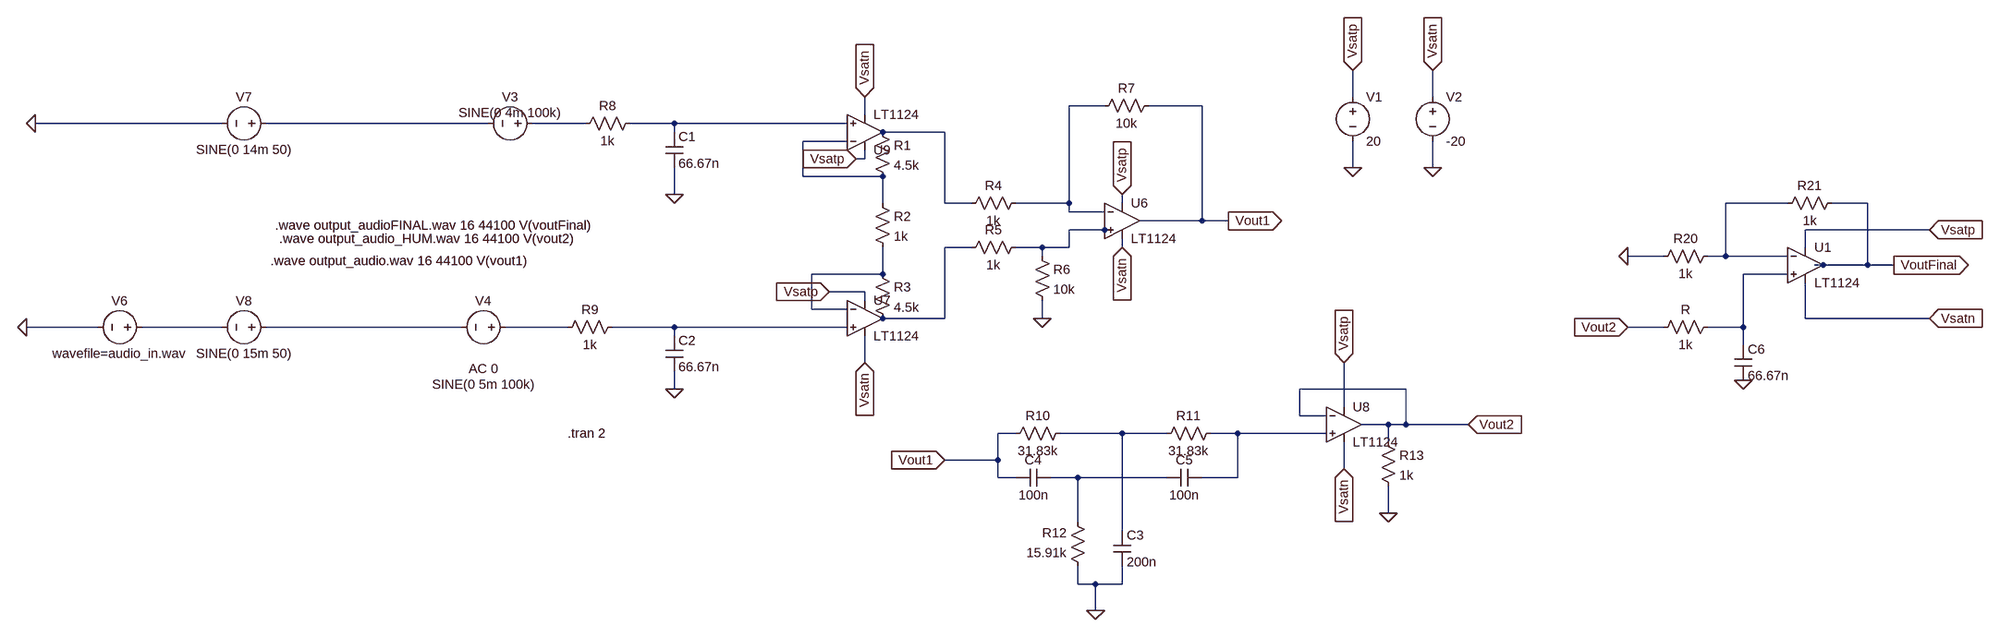
[diagram p0: schematic Instrumental_audio_amplifier_with_50HzhumSuppress.asc]
Instrumental_audio_amplifier_with_50HzhumSuppress.asc, the LTspice schematic file:
Version 4.1
SHEET 1 2400 900
WIRE 816 -48 816 -96
WIRE 960 -48 960 -96
WIRE 368 -32 304 -32
WIRE 544 -32 448 -32
WIRE -64 -16 -64 -48
WIRE -1312 0 -1648 0
WIRE -832 0 -1232 0
WIRE -656 0 -752 0
WIRE -496 0 -576 0
WIRE -96 0 -496 0
WIRE -496 16 -496 0
WIRE 80 16 -32 16
WIRE -96 32 -176 32
WIRE -64 64 -64 48
WIRE -64 64 -80 64
WIRE 816 80 816 32
WIRE 960 80 960 32
WIRE -176 96 -176 32
WIRE -32 96 -176 96
WIRE -496 128 -496 80
WIRE -32 144 -32 96
WIRE 80 144 80 16
WIRE 128 144 80 144
WIRE 304 144 304 -32
WIRE 304 144 208 144
WIRE 400 144 400 128
WIRE 1600 144 1488 144
WIRE 1744 144 1680 144
WIRE 304 160 304 144
WIRE 368 160 304 160
WIRE 544 176 544 -32
WIRE 544 176 432 176
WIRE 592 176 544 176
WIRE 368 192 304 192
WIRE 384 192 368 192
WIRE 1856 192 1632 192
WIRE 128 224 80 224
WIRE 256 224 208 224
WIRE 304 224 304 192
WIRE 304 224 256 224
WIRE 400 224 400 208
WIRE 1632 224 1632 192
WIRE 256 240 256 224
WIRE 1376 240 1312 240
WIRE 1488 240 1488 144
WIRE 1488 240 1456 240
WIRE 1600 240 1488 240
WIRE 1664 256 1648 256
WIRE 1744 256 1744 144
WIRE 1744 256 1664 256
WIRE 1792 256 1744 256
WIRE -32 272 -32 224
WIRE -32 272 -160 272
WIRE 1600 272 1520 272
WIRE -64 304 -128 304
WIRE -64 320 -64 304
WIRE -160 336 -160 272
WIRE -96 336 -160 336
WIRE 80 352 80 224
WIRE 80 352 -32 352
WIRE 256 352 256 320
WIRE 1632 352 1632 288
WIRE 1856 352 1632 352
WIRE -1536 368 -1664 368
WIRE -1312 368 -1456 368
WIRE -880 368 -1232 368
WIRE -688 368 -800 368
WIRE -496 368 -608 368
WIRE -96 368 -496 368
WIRE 1376 368 1312 368
WIRE 1520 368 1520 272
WIRE 1520 368 1456 368
WIRE -496 384 -496 368
WIRE 1520 400 1520 368
WIRE -64 432 -64 384
WIRE -496 480 -496 448
WIRE 912 480 720 480
WIRE 800 512 800 432
WIRE 720 528 720 480
WIRE 768 528 720 528
WIRE 880 544 832 544
WIRE 912 544 912 480
WIRE 912 544 880 544
WIRE 1024 544 912 544
WIRE 208 560 176 560
WIRE 400 560 288 560
WIRE 480 560 400 560
WIRE 608 560 560 560
WIRE 768 560 608 560
WIRE 880 576 880 544
WIRE 176 608 176 560
WIRE 176 608 80 608
WIRE 800 624 800 576
WIRE 176 640 176 608
WIRE 208 640 176 640
WIRE 320 640 272 640
WIRE 480 640 320 640
WIRE 608 640 608 560
WIRE 608 640 544 640
WIRE 880 704 880 656
WIRE 320 720 320 640
WIRE 400 736 400 560
WIRE 320 832 320 800
WIRE 352 832 320 832
WIRE 400 832 400 800
WIRE 400 832 352 832
WIRE 352 880 352 832
FLAG 592 176 Vout1
IOPIN 592 176 Out
FLAG 256 352 0
FLAG 816 -96 Vsatp
IOPIN 816 -96 In
FLAG 960 -96 Vsatn
IOPIN 960 -96 In
FLAG 816 80 0
FLAG 960 80 0
FLAG -80 64 Vsatp
IOPIN -80 64 In
FLAG -128 304 Vsatp
IOPIN -128 304 In
FLAG 400 128 Vsatp
IOPIN 400 128 In
FLAG 400 224 Vsatn
IOPIN 400 224 In
FLAG -64 -48 Vsatn
IOPIN -64 -48 In
FLAG -64 432 Vsatn
IOPIN -64 432 In
FLAG -496 480 0
FLAG -496 128 0
FLAG -1664 368 0
FLAG -1648 0 0
FLAG 880 704 0
FLAG 352 880 0
FLAG 80 608 Vout1
IOPIN 80 608 In
FLAG 800 432 Vsatp
IOPIN 800 432 In
FLAG 800 624 Vsatn
IOPIN 800 624 In
FLAG 1024 544 Vout2
IOPIN 1024 544 In
FLAG 1312 240 0
FLAG 1520 464 0
FLAG 1856 192 Vsatp
IOPIN 1856 192 In
FLAG 1856 352 Vsatn
IOPIN 1856 352 In
FLAG 1792 256 VoutFinal
IOPIN 1792 256 Out
FLAG 1312 368 Vout2
IOPIN 1312 368 In
SYMBOL res -48 0 R0
SYMATTR InstName R1
SYMATTR Value 4.5k
SYMBOL res -48 128 R0
SYMATTR InstName R2
SYMATTR Value 1k
SYMBOL res -48 256 R0
SYMATTR InstName R3
SYMATTR Value 4.5k
SYMBOL res 224 128 R90
WINDOW 0 0 56 VBottom 2
WINDOW 3 32 56 VTop 2
SYMATTR InstName R4
SYMATTR Value 1k
SYMBOL res 224 208 R90
WINDOW 0 0 56 VBottom 2
WINDOW 3 32 56 VTop 2
SYMATTR InstName R5
SYMATTR Value 1k
SYMATTR SpiceLine tol=0
SYMBOL res 240 224 R0
SYMATTR InstName R6
SYMATTR Value 10k
SYMATTR SpiceLine tol=0
SYMBOL voltage 816 -64 R0
WINDOW 123 0 0 Left 0
WINDOW 39 0 0 Left 0
SYMATTR InstName V1
SYMATTR Value 20
SYMBOL voltage 960 -64 R0
WINDOW 123 0 0 Left 0
WINDOW 39 0 0 Left 0
SYMATTR InstName V2
SYMATTR Value -20
SYMBOL res 464 -48 R90
WINDOW 0 0 56 VBottom 2
WINDOW 3 32 56 VTop 2
SYMATTR InstName R7
SYMATTR Value 10k
SYMBOL voltage -736 0 R90
WINDOW 0 -32 56 VBottom 2
WINDOW 3 -4 56 VBottom 2
WINDOW 123 -4 56 VBottom 2
WINDOW 39 0 0 Left 0
SYMATTR InstName V3
SYMATTR Value SINE(0 4m 100k)
SYMBOL voltage -784 368 R90
WINDOW 0 -32 56 VBottom 2
WINDOW 3 88 56 VTop 2
WINDOW 123 60 56 VTop 2
WINDOW 39 0 0 Left 0
SYMATTR InstName V4
SYMATTR Value SINE(0 5m 100k)
SYMATTR Value2 AC 0
SYMBOL res -560 -16 R90
WINDOW 0 0 56 VBottom 2
WINDOW 3 32 56 VTop 2
SYMATTR InstName R8
SYMATTR Value 1k
SYMBOL res -592 352 R90
WINDOW 0 0 56 VBottom 2
WINDOW 3 32 56 VTop 2
SYMATTR InstName R9
SYMATTR Value 1k
SYMBOL cap -512 16 R0
SYMATTR InstName C1
SYMATTR Value 66.67n
SYMBOL cap -512 384 R0
SYMATTR InstName C2
SYMATTR Value 66.67n
SYMBOL voltage -1440 368 R90
WINDOW 0 -32 56 VBottom 2
WINDOW 3 32 56 VTop 2
WINDOW 123 0 0 Left 0
WINDOW 39 0 0 Left 0
SYMATTR InstName V6
SYMATTR Value wavefile=audio_in.wav
SYMBOL res 304 544 R90
WINDOW 0 0 56 VBottom 2
WINDOW 3 32 56 VTop 2
SYMATTR InstName R10
SYMATTR Value 31.83k
SYMBOL res 576 544 R90
WINDOW 0 0 56 VBottom 2
WINDOW 3 32 56 VTop 2
SYMATTR InstName R11
SYMATTR Value 31.83k
SYMBOL res 336 816 R180
WINDOW 0 36 76 Left 2
WINDOW 3 36 40 Left 2
SYMATTR InstName R12
SYMATTR Value 15.91k
SYMBOL cap 384 736 R0
SYMATTR InstName C3
SYMATTR Value 200n
SYMBOL cap 272 624 R90
WINDOW 0 0 32 VBottom 2
WINDOW 3 32 32 VTop 2
SYMATTR InstName C4
SYMATTR Value 100n
SYMBOL cap 544 624 R90
WINDOW 0 0 32 VBottom 2
WINDOW 3 32 32 VTop 2
SYMATTR InstName C5
SYMATTR Value 100n
SYMBOL res 864 560 R0
SYMATTR InstName R13
SYMATTR Value 1k
SYMBOL voltage -1216 0 R90
WINDOW 0 -32 56 VBottom 2
WINDOW 3 32 56 VTop 2
WINDOW 123 0 0 Left 0
WINDOW 39 0 0 Left 0
SYMATTR InstName V7
SYMATTR Value SINE(0 14m 50)
SYMBOL voltage -1216 368 R90
WINDOW 0 -32 56 VBottom 2
WINDOW 3 32 56 VTop 2
WINDOW 123 0 0 Left 0
WINDOW 39 0 0 Left 0
SYMATTR InstName V8
SYMATTR Value SINE(0 15m 50)
SYMBOL res 1472 224 R90
WINDOW 0 0 56 VBottom 2
WINDOW 3 32 56 VTop 2
SYMATTR InstName R20
SYMATTR Value 1k
SYMBOL res 1696 128 R90
WINDOW 0 0 56 VBottom 2
WINDOW 3 32 56 VTop 2
SYMATTR InstName R21
SYMATTR Value 1k
SYMBOL res 1472 352 R90
WINDOW 0 0 56 VBottom 2
WINDOW 3 32 56 VTop 2
SYMATTR InstName R
SYMATTR Value 1k
SYMBOL cap 1504 400 R0
SYMATTR InstName C6
SYMATTR Value 66.67n
SYMBOL OpAmps\\LT1124 400 112 R0
SYMATTR InstName U6
SYMBOL OpAmps\\LT1124 -64 288 R0
SYMATTR InstName U7
SYMBOL OpAmps\\LT1124 800 480 R0
SYMATTR InstName U8
SYMBOL OpAmps\\LT1124 -64 80 M180
SYMATTR InstName U9
SYMBOL OpAmps\\LT1124 1632 192 R0
SYMATTR InstName U1
TEXT -688 560 Left 2 !.tran 2
TEXT -1224 248 Left 2 !.wave output_audio.wav 16 44100 V(vout1)
TEXT -1216 184 Left 2 !.wave output_audioFINAL.wav 16 44100 V(voutFinal)
TEXT -1208 208 Left 2 !.wave output_audio_HUM.wav 16 44100 V(vout2)

The netlist it stands for:
* Instrumental_audio_amplifier_with_50HzhumSuppress.asc
R1 N005 N006 4.5k
R2 N006 N010 1k
R3 N010 N009 4.5k
R4 N001 N005 1k
R5 N008 N009 1k tol=0
R6 N008 0 10k tol=0
V1 Vsatp 0 20
V2 Vsatn 0 -20
R7 Vout1 N001 10k
V3 N003 N002 SINE(0 4m 100k)
V4 N014 N013 SINE(0 5m 100k) AC 0
R8 N004 N003 1k
R9 N015 N014 1k
C1 N004 0 66.67n
C2 N015 0 66.67n
V6 N012 0 wavefile=audio_in.wav
R10 N016 Vout1 31.83k
R11 N017 N016 31.83k
R12 0 N018 15.91k
C3 N016 0 200n
C4 N018 Vout1 100n
C5 N017 N018 100n
R13 Vout2 0 1k
V7 N002 0 SINE(0 14m 50)
V8 N013 N012 SINE(0 15m 50)
R20 N007 0 1k
R21 VoutFinal N007 1k
R N011 Vout2 1k
C6 N011 0 66.67n
X§U6 N008 N001 Vsatp Vsatn Vout1 LT1124  ; pins In+ In- V+ V- OUT
X§U7 N015 N010 Vsatp Vsatn N009 LT1124  ; pins In+ In- V+ V- OUT
X§U8 N017 Vout2 Vsatp Vsatn Vout2 LT1124  ; pins In+ In- V+ V- OUT
X§U9 N004 N006 Vsatp Vsatn N005 LT1124  ; pins In+ In- V+ V- OUT
X§U1 N011 N007 Vsatp Vsatn VoutFinal LT1124  ; pins In+ In- V+ V- OUT
.tran 2
.wave output_audio.wav 16 44100 V(vout1)
.wave output_audioFINAL.wav 16 44100 V(voutFinal)
.wave output_audio_HUM.wav 16 44100 V(vout2)
.lib LTC.lib
.backanno
.end